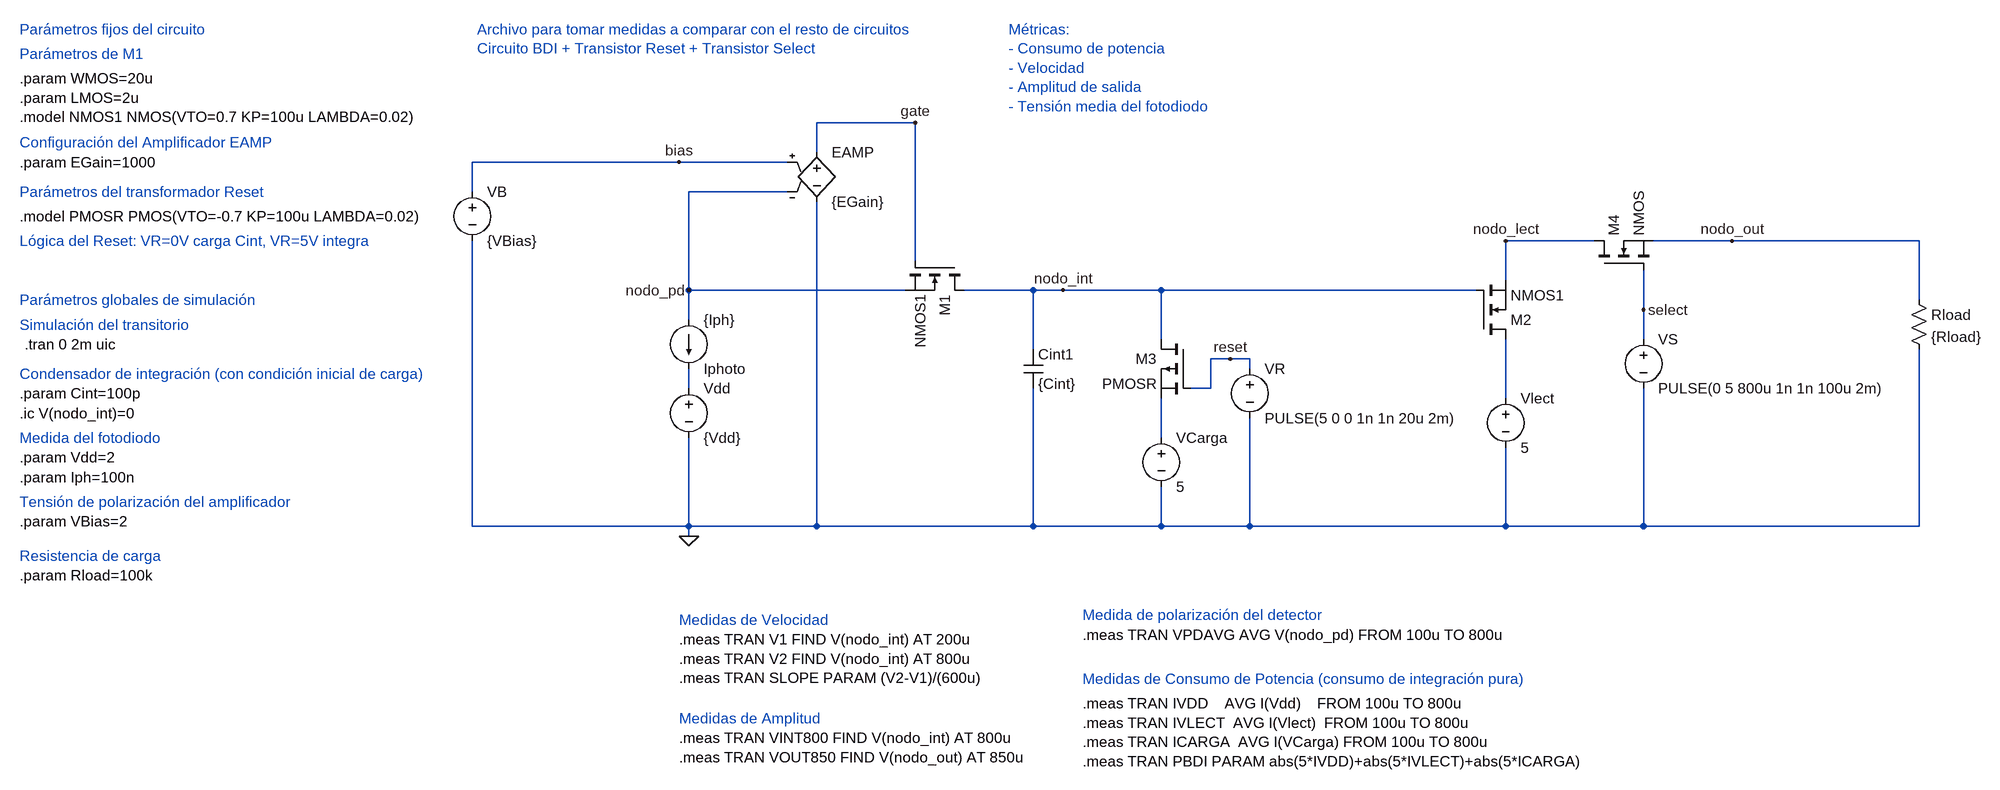
[diagram p0: schematic BDI_Comp.asc]
BDI_Comp.asc, the LTspice schematic file:
Version 4.1
SHEET 1 2260 1888
WIRE 512 32 352 32
WIRE 352 80 352 32
WIRE 128 96 -208 96
WIRE 304 96 128 96
WIRE -208 144 -208 96
WIRE 304 144 144 144
WIRE 1616 224 1472 224
WIRE 1840 224 1712 224
WIRE 2144 224 1840 224
WIRE 512 256 512 32
WIRE 1472 288 1472 224
WIRE 144 304 144 144
WIRE 496 304 144 304
WIRE 704 304 592 304
WIRE 752 304 704 304
WIRE 912 304 752 304
WIRE 1424 304 912 304
WIRE 2144 320 2144 224
WIRE 1696 336 1696 272
WIRE 144 352 144 304
WIRE 912 384 912 304
WIRE 1696 384 1696 336
WIRE 704 400 704 304
WIRE 1024 416 992 416
WIRE 1056 416 1024 416
WIRE 1056 432 1056 416
WIRE 144 464 144 432
WIRE 992 464 992 416
WIRE 992 464 960 464
WIRE 1472 480 1472 384
WIRE 912 544 912 480
WIRE -208 688 -208 224
WIRE 144 688 144 544
WIRE 144 688 -208 688
WIRE 352 688 352 160
WIRE 352 688 144 688
WIRE 704 688 704 464
WIRE 704 688 352 688
WIRE 912 688 912 624
WIRE 912 688 704 688
WIRE 1056 688 1056 512
WIRE 1056 688 912 688
WIRE 1472 688 1472 560
WIRE 1472 688 1056 688
WIRE 1696 688 1696 464
WIRE 1696 688 1472 688
WIRE 2144 688 2144 400
WIRE 2144 688 1696 688
WIRE 144 704 144 688
FLAG 144 704 0
FLAG 144 304 nodo_pd
FLAG 512 32 gate
FLAG 128 96 bias
FLAG 752 304 nodo_int
FLAG 1840 224 nodo_out
FLAG 1024 416 reset
FLAG 1472 224 nodo_lect
FLAG 1696 336 select
SYMBOL e 352 64 R0
SYMATTR InstName EAMP
SYMATTR Value {EGain}
SYMBOL voltage -208 128 R0
SYMATTR InstName VB
SYMATTR Value {VBias}
SYMBOL current 144 352 R0
WINDOW 0 24 80 Left 2
WINDOW 3 24 0 Left 2
WINDOW 123 0 0 Left 0
WINDOW 39 0 0 Left 0
SYMATTR InstName Iphoto
SYMATTR Value {Iph}
SYMBOL nmos 592 256 R90
SYMATTR InstName M1
SYMATTR Value NMOS1
SYMATTR SpiceLine L={LMOS} W={WMOS}
SYMBOL voltage 144 448 R0
SYMATTR InstName Vdd
SYMATTR Value {Vdd}
SYMBOL cap 688 400 R0
SYMATTR InstName Cint1
SYMATTR Value {Cint}
SYMBOL res 2128 304 R0
SYMATTR InstName Rload
SYMATTR Value {Rload}
SYMBOL nmos 1424 384 M180
SYMATTR InstName M2
SYMATTR Value NMOS1
SYMATTR SpiceLine L={LMOS} W={WMOS}
SYMBOL pmos 960 384 M0
SYMATTR InstName M3
SYMATTR Value PMOSR
SYMATTR SpiceLine L={LMOS} W={WMOS}
SYMBOL voltage 1056 416 R0
WINDOW 123 0 0 Left 0
WINDOW 39 0 0 Left 0
SYMATTR InstName VR
SYMATTR Value PULSE(5 0 0 1n 1n 20u 2m)
SYMBOL voltage 912 528 R0
SYMATTR InstName VCarga
SYMATTR Value 5
SYMBOL voltage 1472 464 R0
SYMATTR InstName Vlect
SYMATTR Value 5
SYMBOL nmos 1616 272 R270
SYMATTR InstName M4
SYMATTR SpiceLine L={LMOS} W={WMOS}
SYMBOL voltage 1696 368 R0
SYMATTR InstName VS
SYMATTR Value PULSE(0 5 800u 1n 1n 100u 2m)
TEXT -200 -120 Left 2 ;Archivo para tomar medidas a comparar con el resto de circuitos\nCircuito BDI + Transistor Reset + Transistor Select
TEXT -944 608 Left 2 !.param Iph=100n
TEXT -944 544 Left 2 ;Medida del fotodiodo
TEXT -944 -40 Left 2 !.param WMOS=20u\n.param LMOS=2u\n.model NMOS1 NMOS(VTO=0.7 KP=100u LAMBDA=0.02)
TEXT -944 -80 Left 2 ;Parámetros de M1
TEXT -944 680 Left 2 !.param VBias=2
TEXT -944 648 Left 2 ;Tensión de polarización del amplificador
TEXT -936 392 Left 2 !.tran 0 2m uic
TEXT -944 576 Left 2 !.param Vdd=2
TEXT -944 96 Left 2 !.param EGain=1000
TEXT -944 64 Left 2 ;Configuración del Amplificador EAMP
TEXT -944 504 Left 2 !.ic V(nodo_int)=0
TEXT -944 440 Left 2 ;Condensador de integración (con condición inicial de carga)
TEXT -944 472 Left 2 !.param Cint=100p
TEXT -944 736 Left 2 ;Resistencia de carga
TEXT -944 768 Left 2 !.param Rload=100k
TEXT -944 360 Left 2 ;Simulación del transitorio
TEXT -944 144 Left 2 ;Parámetros del transformador Reset
TEXT -944 184 Left 2 !.model PMOSR PMOS(VTO=-0.7 KP=100u LAMBDA=0.02)
TEXT -944 224 Left 2 ;Lógica del Reset: VR=0V carga Cint, VR=5V integra
TEXT -944 -120 Left 2 ;Parámetros fijos del circuito
TEXT -944 320 Left 2 ;Parámetros globales de simulación
TEXT 128 840 Left 2 ;Medidas de Velocidad
TEXT 128 872 Left 2 !.meas TRAN V1 FIND V(nodo_int) AT 200u\n.meas TRAN V2 FIND V(nodo_int) AT 800u\n.meas TRAN SLOPE PARAM (V2-V1)/(600u)
TEXT 128 1000 Left 2 ;Medidas de Amplitud
TEXT 128 1032 Left 2 !.meas TRAN VINT800 FIND V(nodo_int) AT 800u\n.meas TRAN VOUT850 FIND V(nodo_out) AT 850u
TEXT 784 832 Left 2 ;Medida de polarización del detector
TEXT 784 864 Left 2 !.meas TRAN VPDAVG AVG V(nodo_pd) FROM 100u TO 800u
TEXT 784 936 Left 2 ;Medidas de Consumo de Potencia (consumo de integración pura)
TEXT 664 -120 Left 2 ;Métricas:\n- Consumo de potencia\n- Velocidad\n- Amplitud de salida\n- Tensión media del fotodiodo
TEXT 784 976 Left 2 !.meas TRAN IVDD    AVG I(Vdd)    FROM 100u TO 800u\n.meas TRAN IVLECT  AVG I(Vlect)  FROM 100u TO 800u\n.meas TRAN ICARGA  AVG I(VCarga) FROM 100u TO 800u\n.meas TRAN PBDI PARAM abs(5*IVDD)+abs(5*IVLECT)+abs(5*ICARGA)

The netlist it stands for:
* BDI_Comp.asc
EAMP gate 0 bias nodo_pd {EGain}
VB bias 0 {VBias}
Iphoto nodo_pd N001 {Iph}
M1 nodo_int gate nodo_pd nodo_pd NMOS1 L={LMOS} W={WMOS}
Vdd N001 0 {Vdd}
Cint1 nodo_int 0 {Cint}
Rload nodo_out 0 {Rload}
M2 N002 nodo_int nodo_lect nodo_lect NMOS1 L={LMOS} W={WMOS}
M3 nodo_int reset N003 N003 PMOSR L={LMOS} W={WMOS}
VR reset 0 PULSE(5 0 0 1n 1n 20u 2m)
VCarga N003 0 5
Vlect N002 0 5
M4 nodo_lect select nodo_out nodo_out NMOS L={LMOS} W={WMOS}
VS select 0 PULSE(0 5 800u 1n 1n 100u 2m)
.model NMOS NMOS
.model PMOS PMOS
.lib standard.mos
* Archivo para tomar medidas a comparar con el resto de circuitos
* Circuito BDI + Transistor Reset + Transistor Select
.param Iph=100n
* Medida del fotodiodo
.param WMOS=20u
.param LMOS=2u
.model NMOS1 NMOS(VTO=0.7 KP=100u LAMBDA=0.02)
* Parámetros de M1
.param VBias=2
* Tensión de polarización del amplificador
.tran 0 2m uic
.param Vdd=2
.param EGain=1000
* Configuración del Amplificador EAMP
.ic V(nodo_int)=0
* Condensador de integración (con condición inicial de carga)
.param Cint=100p
* Resistencia de carga
.param Rload=100k
* Simulación del transitorio
* Parámetros del transformador Reset
.model PMOSR PMOS(VTO=-0.7 KP=100u LAMBDA=0.02)
* Lógica del Reset: VR=0V carga Cint, VR=5V integra
* Parámetros fijos del circuito
* Parámetros globales de simulación
* Medidas de Velocidad
.meas TRAN V1 FIND V(nodo_int) AT 200u
.meas TRAN V2 FIND V(nodo_int) AT 800u
.meas TRAN SLOPE PARAM (V2-V1)/(600u)
* Medidas de Amplitud
.meas TRAN VINT800 FIND V(nodo_int) AT 800u
.meas TRAN VOUT850 FIND V(nodo_out) AT 850u
* Medida de polarización del detector
.meas TRAN VPDAVG AVG V(nodo_pd) FROM 100u TO 800u
* Medidas de Consumo de Potencia (consumo de integración pura)
* Métricas:
* - Consumo de potencia
* - Velocidad
* - Amplitud de salida
* - Tensión media del fotodiodo
.meas TRAN IVDD    AVG I(Vdd)    FROM 100u TO 800u
.meas TRAN IVLECT  AVG I(Vlect)  FROM 100u TO 800u
.meas TRAN ICARGA  AVG I(VCarga) FROM 100u TO 800u
.meas TRAN PBDI PARAM abs(5*IVDD)+abs(5*IVLECT)+abs(5*ICARGA)
.backanno
.end